# EAGLE schematic od-aws (EAGLE 9.6.2)
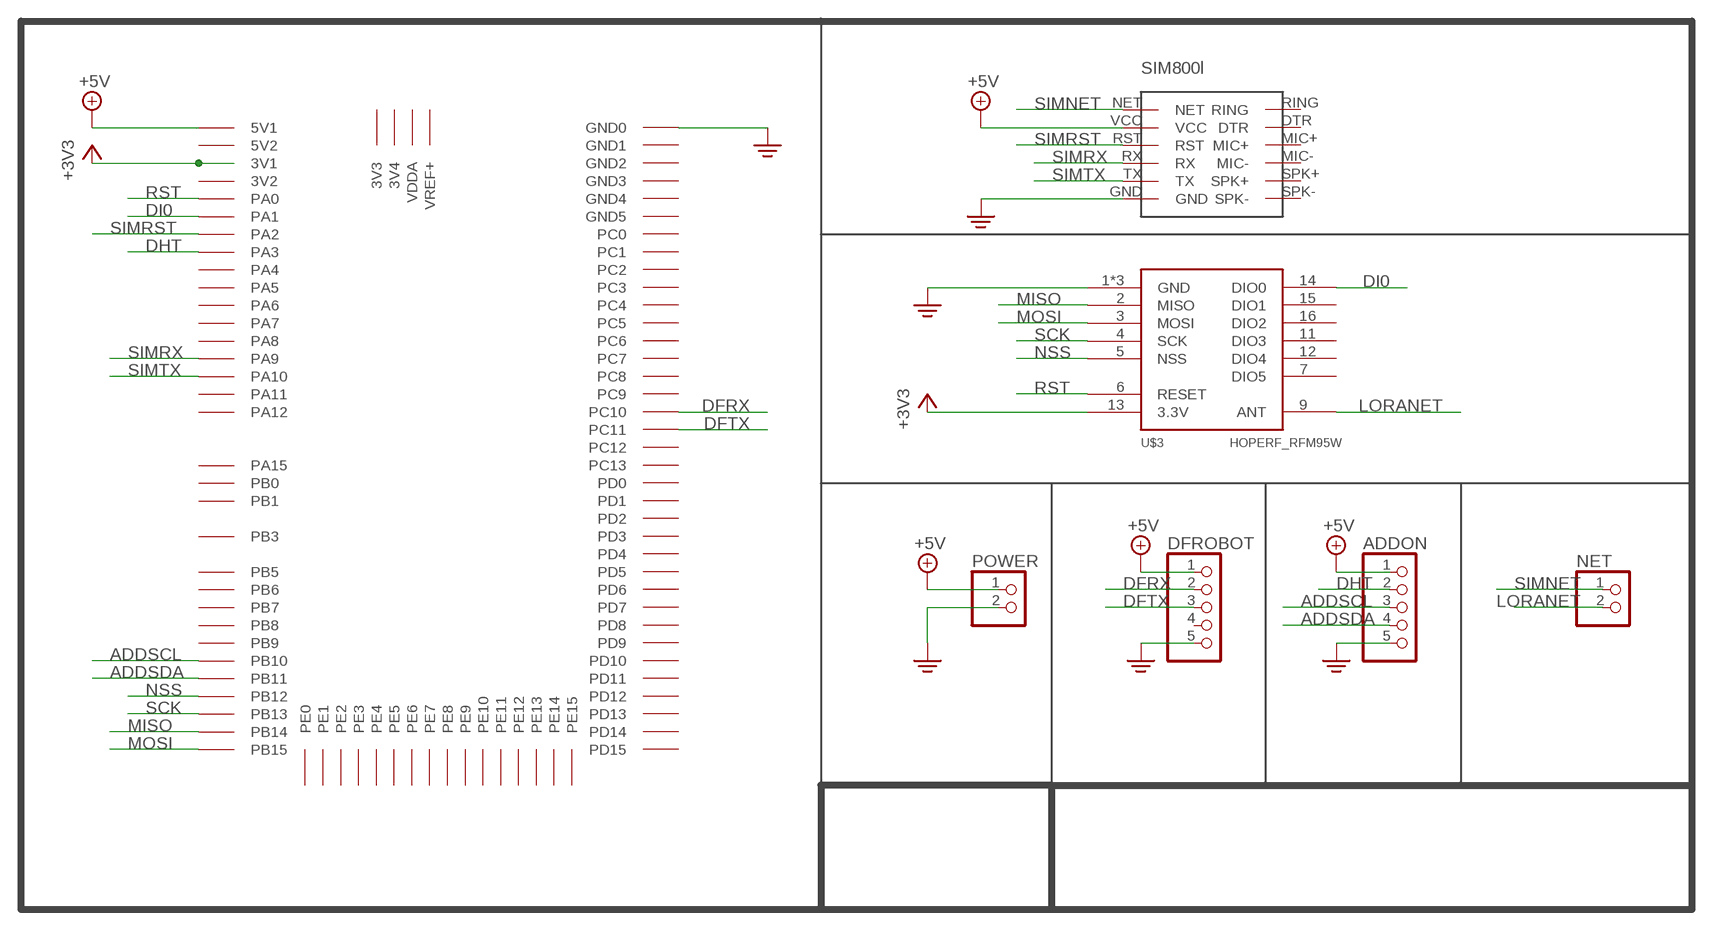
[diagram p0: schematic, sheet 1]

## Parts
ADDON  PINHD-1X5/90  [1X05/90]
DFROBOT  PINHD-1X5/90  [1X05/90]
NET  PINHD-1X2/90  [1X02/90]
POWER  PINHD-1X2/90  [1X02/90]
U$1  STM32F407VGT6  [STM32F407VGT6]
U$2  SIM800L-V1  [SIM800L-V1]
U$3  HOPERF_RFM95W  [HOPERF_RFM95W]

## Nets
+3V3: U$1.3V31(3V1) U$3.13(3.3V)
+5V: ADDON.1 DFROBOT.1 POWER.1 U$1.5V1 U$2.VCC
ADDSCL: ADDON.3 U$1.PB10
ADDSDA: ADDON.4 U$1.PB11
DFRX: DFROBOT.2 U$1.PC10
DFTX: DFROBOT.3 U$1.PC11
DHT: ADDON.2 U$1.PA3
DI0: U$1.PA1 U$3.14(DIO0)
LORANET: NET.2 U$3.9(ANT)
MISO: U$1.PB14 U$3.2(MISO)
MOSI: U$1.PB15 U$3.3(MOSI)
NSS: U$1.PB12 U$3.5(NSS)
PE: ADDON.5 DFROBOT.5 POWER.2 U$1.GND1(GND0) U$2.GND U$3.1(GND) U$3.8(GND) U$3.10(GND)
RST: U$1.PA0 U$3.6(RESET)
SCK: U$1.PB13 U$3.4(SCK)
SIMNET: NET.1 U$2.NET
SIMRST: U$1.PA2 U$2.RST
SIMRX: U$1.PA9 U$2.RX
SIMTX: U$1.PA10 U$2.TX
Unconnected: DFROBOT.4 U$1.3V32(3V2) U$1.3V33(3V3) U$1.3V34(3V4) U$1.5V2 U$1.GND2(GND1) U$1.GND3(GND2) U$1.GND4(GND3) U$1.GND5(GND4) U$1.GND7(GND5) U$1.PA4 U$1.PA5 U$1.PA6 U$1.PA7 U$1.PA8 U$1.PA11 U$1.PA12 U$1.PA15 U$1.PB0 U$1.PB1 U$1.PB3 U$1.PB5 U$1.PB6 U$1.PB7 U$1.PB8 U$1.PB9 U$1.PC0 U$1.PC1 U$1.PC2 U$1.PC3 U$1.PC4 U$1.PC5 U$1.PC6 U$1.PC7 U$1.PC8 U$1.PC9 U$1.PC12 U$1.PC13 U$1.PD0 U$1.PD1 U$1.PD2 U$1.PD3 U$1.PD4 U$1.PD5 U$1.PD6 U$1.PD7 U$1.PD8 U$1.PD9 U$1.PD10 U$1.PD11 U$1.PD12 U$1.PD13 U$1.PD14 U$1.PD15 U$1.PE0 U$1.PE1 U$1.PE2 U$1.PE3 U$1.PE4 U$1.PE5 U$1.PE6 U$1.PE7 U$1.PE8 U$1.PE9 U$1.PE10 U$1.PE11 U$1.PE12 U$1.PE13 U$1.PE14 U$1.PE15 U$1.VDDA U$1.VREF+ U$2.DTR U$2.MIC+ U$2.MIC- U$2.RING U$2.SPK+ U$2.SPK- U$3.7(DIO5) U$3.11(DIO3) U$3.12(DIO4) U$3.15(DIO1) U$3.16(DIO2)

## Library data of the parts
ADDON DFROBOT = pinhead:PINHD-1X5: PIN HEADER
NET POWER = pinhead:PINHD-1X2: PIN HEADER
U$1 = stm32f407vgt6:STM32F407VGT6
U$2 = sim800l-v1:SIM800L-V1
U$3 = lora-lorawan-modules:HOPERF_RFM95W: HopeRF LoRaWAN modules Link: http://www.hoperf.com/rf_transceiver/lora/; HEIGHT: 1.8; LENGTH: 16; WIDTH: 16